# EAGLE schematic esquematico (EAGLE 9.6.1)
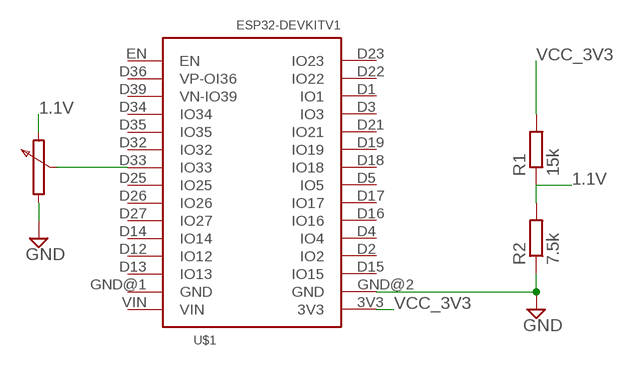
[diagram p0: schematic, sheet 1]

## Parts
R1  15k  R-EU_0204/5  [0204/5]
R2  7.5k  R-EU_0204/5  [0204/5]
U$1  ESP32DEVKITV1  [ESP32-DEVKITV1]

## Nets
1.1V: R1.1 R2.2
GND: R2.1 U$1.GND@2(GND)
N$1: U$1.D33(IO33)
VCC_3V3: R1.2 U$1.3V3
Unconnected: U$1.D1(IO1) U$1.D2(IO2) U$1.D3(IO3) U$1.D4(IO4) U$1.D5(IO5) U$1.D12(IO12) U$1.D13(IO13) U$1.D14(IO14) U$1.D15(IO15) U$1.D16(IO16) U$1.D17(IO17) U$1.D18(IO18) U$1.D19(IO19) U$1.D21(IO21) U$1.D22(IO22) U$1.D23(IO23) U$1.D25(IO25) U$1.D26(IO26) U$1.D27(IO27) U$1.D32(IO32) U$1.D34(IO34) U$1.D35(IO35) U$1.D36(VP-OI36) U$1.D39(VN-IO39) U$1.EN U$1.GND@1(GND) U$1.VIN

## Library data of the parts
R1 R2 = rcl:R-EU_: RESISTOR, European symbol; SPICEPREFIX: R
U$1 = ESP32-DEVKITV1:ESP32DEVKITV1